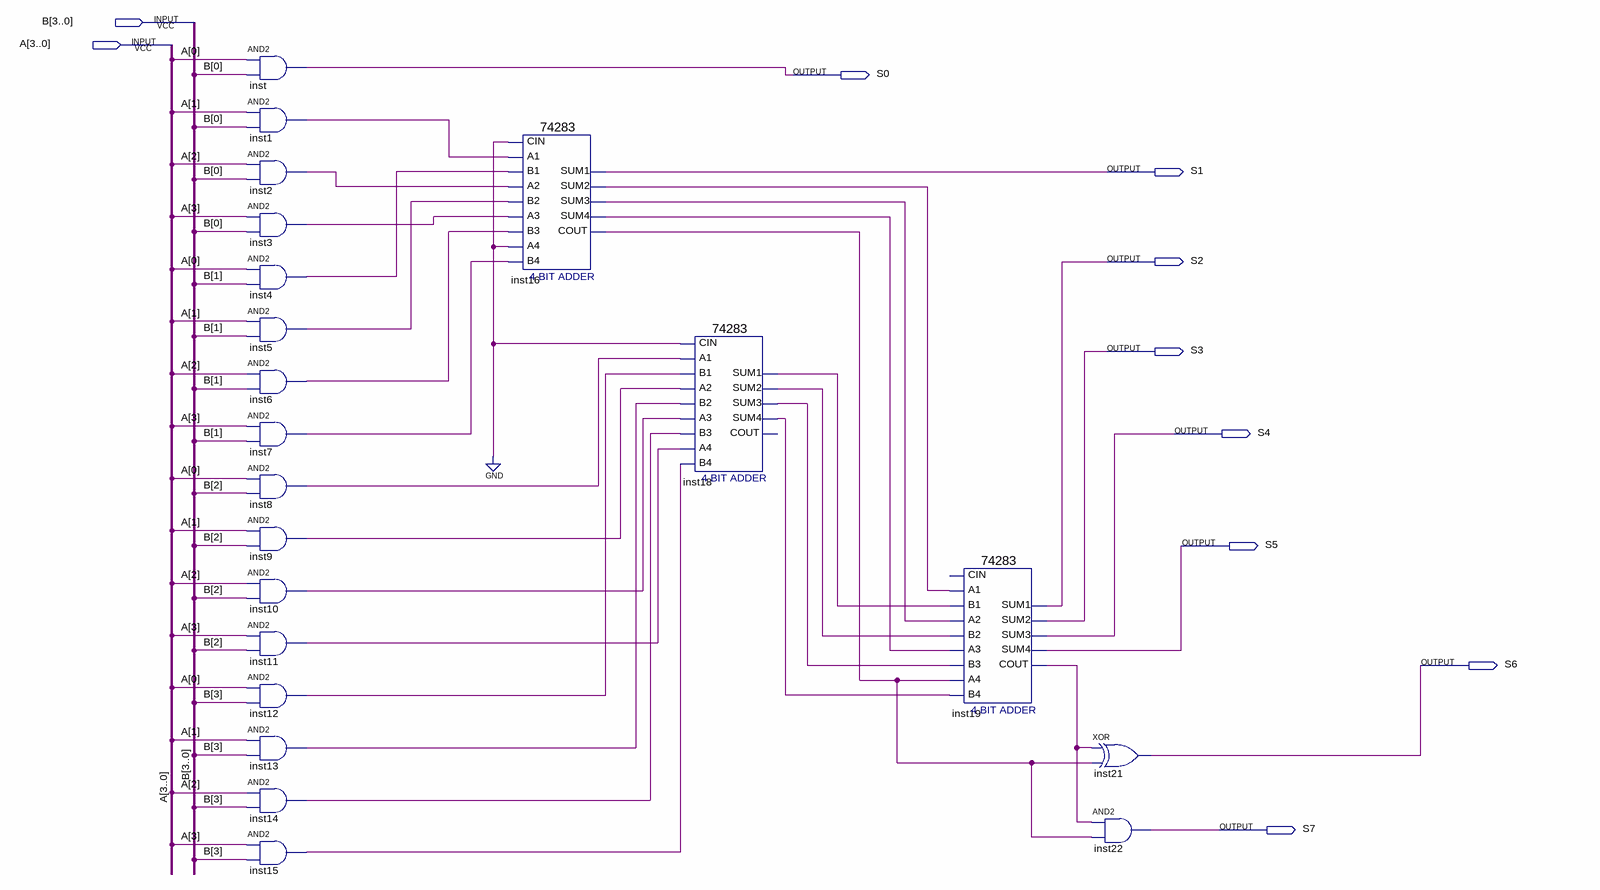
[diagram p0: schematic sheet]
// Quartus schematic DECO.bdf as structural Verilog: 21 symbols, 10 pins
module DECO (
  input  [3:0] B,
  input  [3:0] A,
  output S0,
  output S1,
  output S2,
  output S3,
  output S4,
  output S5,
  output S6,
  output S7
);

  wire inst1_out, inst2_out, inst3_out, inst4_out, inst5_out, inst6_out, inst7_out, inst8_out, inst9_out,
       inst10_out, inst11_out, inst12_out, inst13_out, inst14_out, inst15_out, inst16_cout, inst16_sum2,
       inst16_sum3, inst16_sum4, inst18_sum1, inst18_sum2, inst18_sum3, inst18_sum4, inst19_cout;

  and inst (S0, A[0], B[0]);
  and inst1 (inst1_out, A[1], B[0]);
  and inst2 (inst2_out, A[2], B[0]);
  and inst3 (inst3_out, A[3], B[0]);
  and inst4 (inst4_out, A[0], B[1]);
  and inst5 (inst5_out, A[1], B[1]);
  and inst6 (inst6_out, A[2], B[1]);
  and inst7 (inst7_out, A[3], B[1]);
  and inst8 (inst8_out, A[0], B[2]);
  and inst9 (inst9_out, A[1], B[2]);
  and inst10 (inst10_out, A[2], B[2]);
  and inst11 (inst11_out, A[3], B[2]);
  and inst12 (inst12_out, A[0], B[3]);
  and inst13 (inst13_out, A[1], B[3]);
  and inst14 (inst14_out, A[2], B[3]);
  and inst15 (inst15_out, A[3], B[3]);
  \74283  inst16 (
    .CIN(1'b0), .A1(inst1_out), .A2(inst2_out), .B2(inst5_out), .A3(inst3_out), .A4(1'b0), .B4(inst7_out),
    .B1(inst4_out), .B3(inst6_out), .SUM4(inst16_sum4), .COUT(inst16_cout), .SUM1(S1), .SUM2(inst16_sum2),
    .SUM3(inst16_sum3));
  \74283  inst18 (
    .CIN(1'b0), .A1(inst8_out), .A2(inst9_out), .B2(inst13_out), .A3(inst10_out), .A4(inst11_out),
    .B4(inst15_out), .B1(inst12_out), .B3(inst14_out), .SUM4(inst18_sum4), .SUM1(inst18_sum1),
    .SUM2(inst18_sum2), .SUM3(inst18_sum3));  // open: COUT
  \74283  inst19 (
    .A1(inst16_sum2), .A2(inst16_sum3), .B2(inst18_sum2), .A3(inst16_sum4), .A4(inst16_cout),
    .B4(inst18_sum4), .B1(inst18_sum1), .B3(inst18_sum3), .SUM4(S5), .COUT(inst19_cout), .SUM1(S2),
    .SUM2(S3), .SUM3(S4));  // open: CIN
  xor inst21 (S6, inst19_cout, inst16_cout);
  and inst22 (S7, inst19_cout, inst16_cout);
endmodule
